# Altium project EDR - Water Meter (Test point).PrjPcb
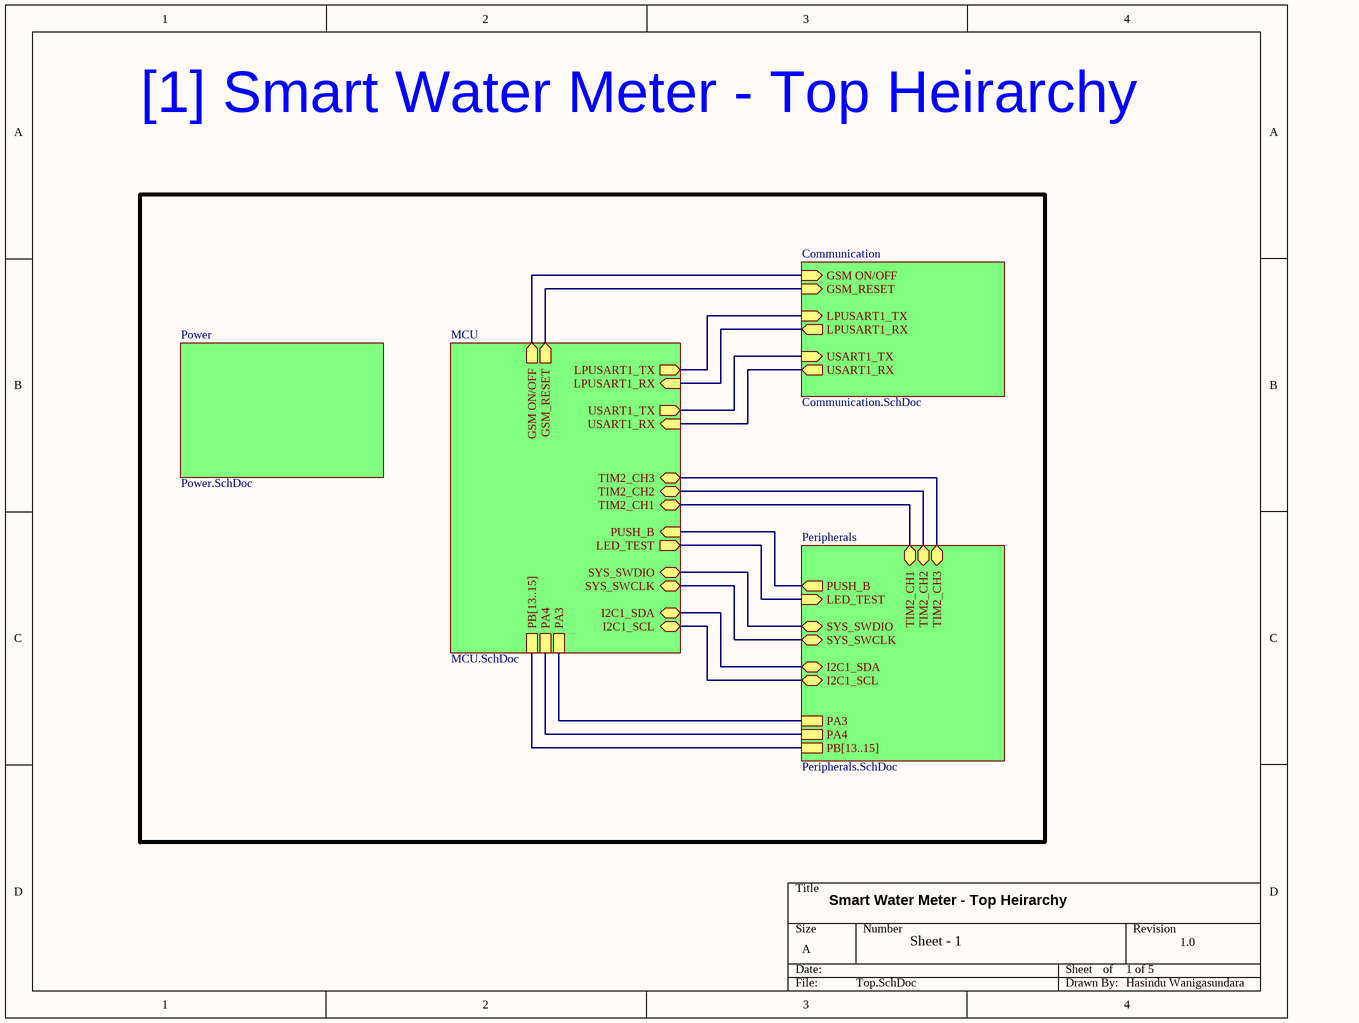
[diagram p0: Top.SchDoc]
5 sheets, 60 parts. Net scope: hierarchical (ports join the sheet entries above them; power ports are global).
Board file: EDR - Water Meter.PcbDoc
Sheets:
  Top.SchDoc
    Communication = Communication.SchDoc
    MCU = MCU.SchDoc
    Peripherals = Peripherals.SchDoc
    Power = Power.SchDoc

## Sheet Top.SchDoc
size A; SheetNumber: 1; SheetTotal: 5

### Sub-sheets
Communication = Communication.SchDoc: USART1_RX (out), USART1_TX (in), LPUSART1_RX (out), LPUSART1_TX (in), GSM_RESET (in), GSM ON/OFF (in)
MCU = MCU.SchDoc: SYS_SWDIO (bidir), SYS_SWCLK (bidir), PUSH_B (in), LED_TEST (out), LPUSART1_TX (out), LPUSART1_RX (in), USART1_TX (out), USART1_RX (in), GSM_RESET (out), GSM ON/OFF (out), I2C1_SCL (bidir), I2C1_SDA (bidir), PA3, PA4, PB[13..15], TIM2_CH1 (bidir), TIM2_CH2 (bidir), TIM2_CH3 (bidir)
Peripherals = Peripherals.SchDoc: SYS_SWDIO (bidir), SYS_SWCLK (bidir), PUSH_B (out), LED_TEST (in), I2C1_SCL (bidir), PA3, PA4, I2C1_SDA (bidir), PB[13..15], TIM2_CH1 (bidir), TIM2_CH2 (bidir), TIM2_CH3 (bidir)
Power = Power.SchDoc: no entries

### Nets
I2C1_SCL: sheet MCU/I2C1_SCL, sheet Peripherals/I2C1_SCL
I2C1_SDA: sheet MCU/I2C1_SDA, sheet Peripherals/I2C1_SDA
NetB50_2: sheet MCU/LED_TEST, sheet Peripherals/LED_TEST
NetJ51_1: sheet MCU/PA3, sheet Peripherals/PA3
NetJ51_2: sheet MCU/PA4, sheet Peripherals/PA4
NetJ52_3: sheet MCU/TIM2_CH2, sheet Peripherals/TIM2_CH2
NetJ53_3: sheet MCU/TIM2_CH1, sheet Peripherals/TIM2_CH1
NetJ54_3: sheet MCU/TIM2_CH3, sheet Peripherals/TIM2_CH3
NetJ55_1: sheet MCU/PUSH_B, sheet Peripherals/PUSH_B
NetP51_2: sheet MCU/SYS_SWDIO, sheet Peripherals/SYS_SWDIO
NetP51_3: sheet MCU/SYS_SWCLK, sheet Peripherals/SYS_SWCLK
NetR41_1: sheet Communication/GSM ON/OFF, sheet MCU/GSM ON/OFF
NetS41_1: sheet Communication/GSM_RESET, sheet MCU/GSM_RESET
NetS42_1: sheet Communication/USART1_TX, sheet MCU/USART1_TX
NetS43_1: sheet Communication/LPUSART1_TX, sheet MCU/LPUSART1_TX
NetS44_1: sheet Communication/LPUSART1_RX, sheet MCU/LPUSART1_RX
NetS45_1: sheet Communication/USART1_RX, sheet MCU/USART1_RX

### Buses and harness runs
bus sheet MCU/PB[13..15] = sheet Peripherals/PB[13..15]

### Notes on the sheet
- [1] Smart Water Meter - Top Heirarchy
- Smart Water Meter - Top Heirarchy
- Sheet - 1
- 1 of 5
- 1.0
- Hasindu Wanigasundara

## Sheet Communication.SchDoc
size A; SheetNumber: 4; SheetTotal: 5
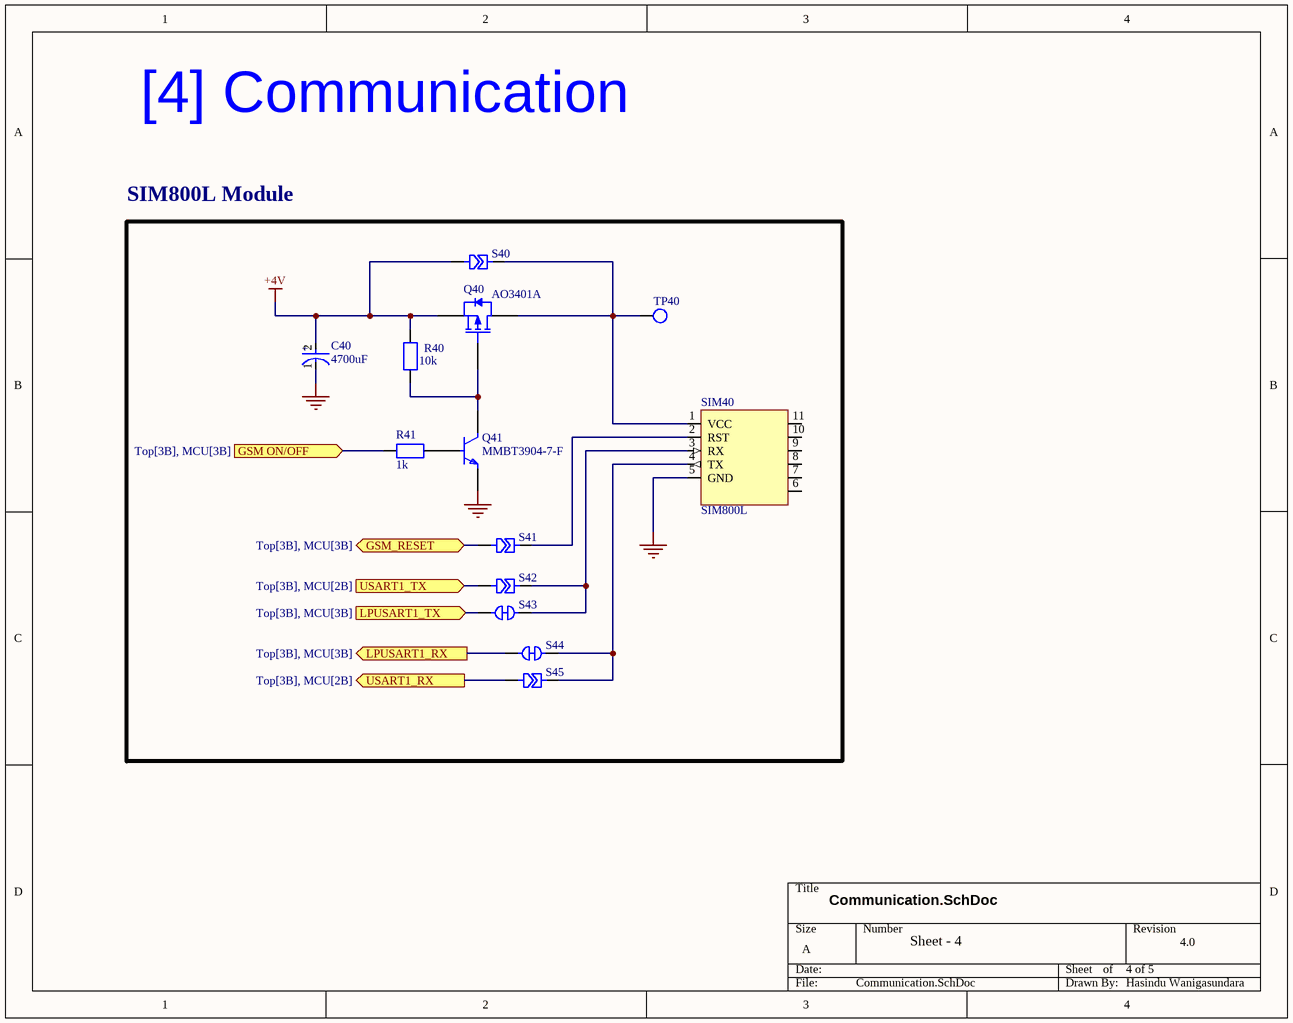
[diagram p1: Communication.SchDoc]

### Parts
C40  4700uF  [FP-RAD-TH-D_12_5_0_5-L_30-MFG]
Q40  AO3401A  [AO-SOT-23-3L_V]
Q41  MMBT3904-7-F  [FP-SOT23-IPC_A]
R40  10k  [RES_1206]
R41  1k  [RES_1206]
S40  Triangular SB  [Solder Bridge Triangular]  (value not drawn)
S41  Triangular SB  [Solder Bridge Triangular]  (value not drawn)
S42  Triangular SB  [Solder Bridge Triangular]  (value not drawn)
S43  Soldering Bridge close  [Circular jumper close]  (value not drawn)  (net tie, no BOM)
S44  Soldering Bridge close  [Circular jumper close]  (value not drawn)  (net tie, no BOM)
S45  Triangular SB  [Solder Bridge Triangular]  (value not drawn)
SIM40  SIM800L  [SIM800L]
TP40  Test Pad  [Test Pad]  (value not drawn)

### Blocks framed on the sheet
SIM800L Module: C40 Q40 Q41 R40 R41 S40-S45 SIM40 TP40

### Ports
GSM ON/OFF (in, see Top[3B], MCU[3B]), GSM_RESET (bidir, see Top[3B], MCU[3B]), LPUSART1_RX (out, see Top[3B], MCU[3B]), LPUSART1_TX (in, see Top[3B], MCU[3B]), USART1_RX (out, see Top[3B], MCU[2B]), USART1_TX (in, see Top[3B], MCU[2B])

### Nets
+4V: C40.2(A) Q40.2(SOURCE) R40.1 S40.1
GND: C40.1(C) Q41.2(E) SIM40.5(GND)
NetQ40_1: Q40.1(GATE) Q41.3(C) R40.2
NetQ40_3: Q40.3(DRAIN) S40.2 SIM40.1(VCC) TP40.1
NetQ41_1: Q41.1(B) R41.2
NetR41_1: R41.1 ; port GSM ON/OFF
NetS41_1: S41.1 ; port GSM_RESET
NetS41_2: S41.2 SIM40.2(RST)
NetS42_1: S42.1 ; port USART1_TX
NetS42_2: S42.2 S43.2 SIM40.3(RX)
NetS43_1: S43.1 ; port LPUSART1_TX
NetS44_1: S44.1 ; port LPUSART1_RX
NetS44_2: S44.2 S45.2 SIM40.4(TX)
NetS45_1: S45.1 ; port USART1_RX

Not connected (* = marked no-connect by the designer): SIM40 6 7 8 9 10 11

### Notes on the sheet
- [4] Communication
- Communication.SchDoc
- Sheet - 4
- 4 of 5
- 4.0
- Hasindu Wanigasundara
- (in symbol CMP-05427-000691-1) +

### Library data of the parts
C40 = CMP-05427-000691-1: Aluminum Electrolytic Capacitors (Radial Lead Type) AEC-Q200 Qualified 4700uF ±20% 10V
Q40 = CMP-2000-05778-1: P-Channel MOSFET, 30 V, 4 A, -55 to 150 degC, 3-Pin SOT-23-3L, RoHS, Tape and Reel; Manufacturer: Alpha and Omega; Output Power (Max): NotRequiredW; Power Dissipation: 1.4W; Rad Hardened: No; Drain Efficiency: NotRequired%; Drain-Source On-Volt: 30V; Noise Figure: NotRequireddB; Frequency (Max): NotRequiredMHz; Number of  Elements: 1; Gate-Source Voltage (Max): ?12V; Drain Current (Max): 4A; Channel Mode: Enhancement; Drain-Source On-Res: 0.044ohm; Type: PowerMOSFET; Polarity: P; Package URL: http://www.aosmd.com/res/packaging_information/SOT-23-3L.pdf; Datasheet URL: http://www.aosmd.com/res/data_sheets/AO3401A.pdf; Package Type: SOT-23; Package Description: 3-Pin Small Outline Transistor, Body 2.95 x 1.6 mm, Pitch 0.95 mm; Mounting: SurfaceMount; Manufacturer URL: http://www.aosmd.com/; Continuous Drain Current: 4A; Package Reference: SOT-23-3L; Mounting Technology: SurfaceMount; Operating Temperature Classification: Military; Power Gain: NotRequireddB; Datasheet Version: Rev. 3, 03/2011; Operating Temp Range: -55Cto150C; Pin Count: 3
Q41 = CMP-2000-04931-2: TRANS NPN 40V 0.2A SMD SOT23-3; Frequency: 300MHz; Power Dissipation: 350mW; Element Configuration: Single; Max Power Dissipation: 300mW; Max Collector Current: 200mA; Collector Emitter Saturation Voltage: 300mV; Number of Elements: 1; hFE Min: 100; Collector Base Voltage (VCBO): 60V; Emitter Base Voltage (VEBO): 6V; Contact Plating: Tin; Package Quantity: 3000; Max Frequency: 300MHz; REACH SVHC: No SVHC; Max Operating Temperature: 150°C; Width: 1.4mm; Collector Emitter Voltage (VCEO): 40V; Voltage Rating (DC): 40V; Radiation Hardening: No; Case/Package: SOT-23; Height: 1mm; Collector Emitter Breakdown Voltage: 40V; Length: 3.05mm; Polarity: NPN; Packaging: Tape and Reel; Number of Pins: 3; Min Operating Temperature: -55°C; Gain Bandwidth Product: 300MHz; Mount: Surface Mount; Weight: 0.000282oz; Continuous Collector Current: 200mA; Transition Frequency: 300MHz; Max Breakdown Voltage: 40V; Lead Free: Lead Free
R40 R41 = RES_1206: SMD 3.2mm × 1.6mm size resistor (1206); Manufacturer: *; Manufacturer part number: *
S40-S42 S45 = Triangular SB: Solder Bridge triangular closed
S43 S44 = Soldering Bridge close: Soldering Bridge close SMD
SIM40 = SIM800L: SIM800L through hole gsm module

## Sheet MCU.SchDoc
size A; SheetNumber: 3; SheetTotal: 5
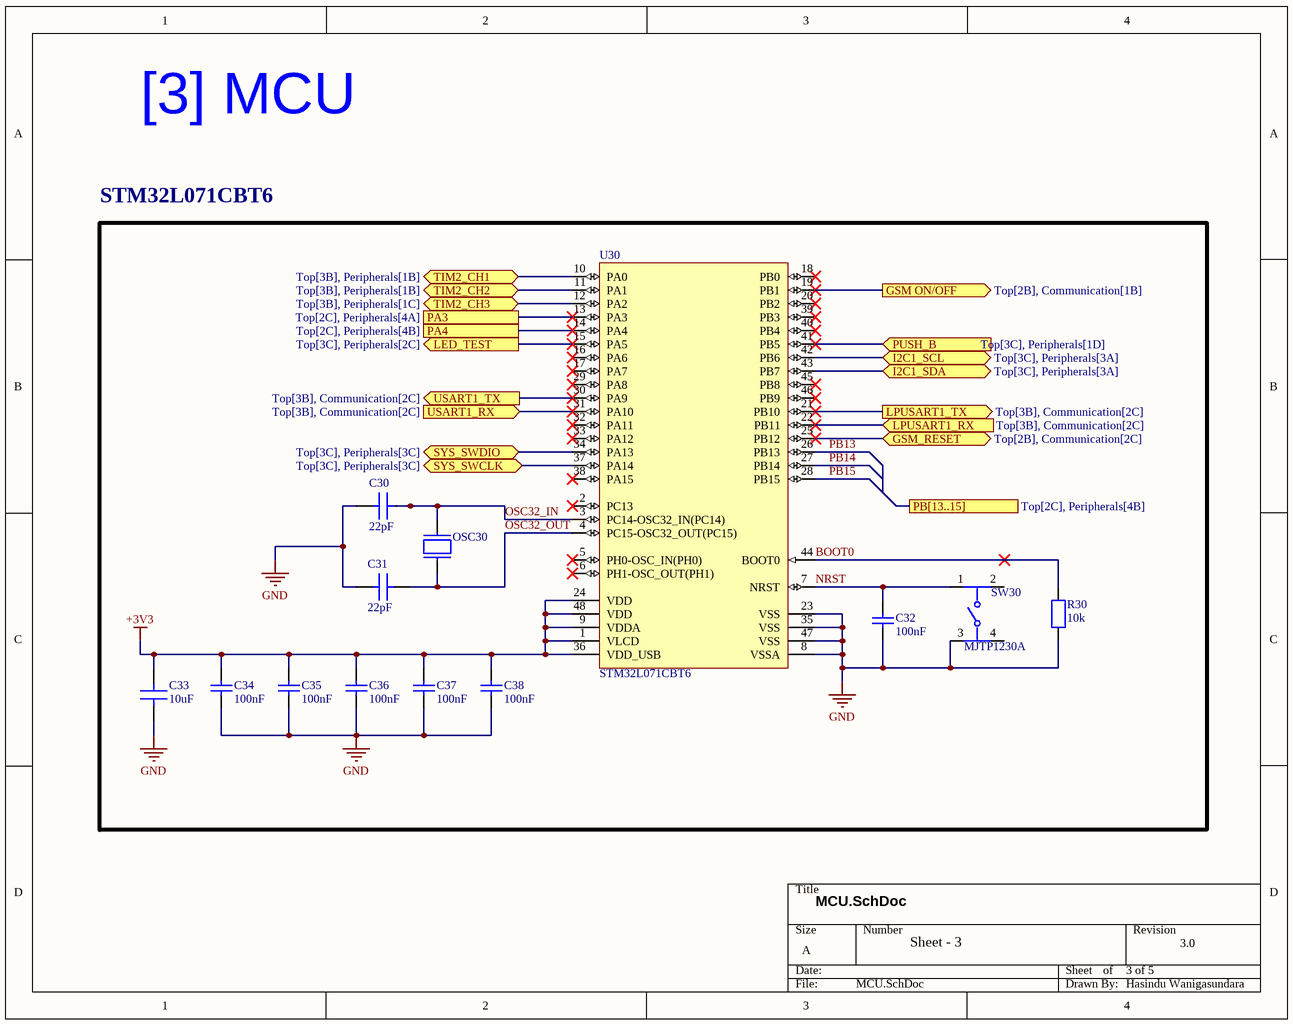
[diagram p2: MCU.SchDoc]

### Parts
C30  22pF  [CAP_1206]
C31  22pF  [CAP_1206]
C32  100nF  [CAPC2013X140X50NL20T25]
C33  10uF  [CAP_1206]
C34  100nF  [CAPC2013X140X50NL20T25]
C35  100nF  [CAPC2013X140X50NL20T25]
C36  100nF  [CAPC2013X140X50NL20T25]
C37  100nF  [CAPC2013X140X50NL20T25]
C38  100nF  [CAPC2013X140X50NL20T25]
OSC30  CRYSTAL OSC  [Crystal_OSC]  (value not drawn)
R30  10k  [RES_1206]
SW30  MJTP1230A  [FP-MJTP1230A-MFG]
U30  STM32L071CBT6  [STM-LQFP48_M]

### Blocks framed on the sheet
STM32L071CBT6: C30-C38 OSC30 R30 SW30 U30

### Ports
GSM ON/OFF (out, see Top[2B], Communication[1B]), GSM_RESET (bidir, see Top[2B], Communication[2C]), I2C1_SCL (bidir, see Top[3C], Peripherals[3A]), I2C1_SDA (bidir, see Top[3C], Peripherals[3A]), LED_TEST (out, see Top[3C], Peripherals[2C]), LPUSART1_RX (in, see Top[3B], Communication[2C]), LPUSART1_TX (out, see Top[3B], Communication[2C]), PA3 (see Top[2C], Peripherals[4A]), PA4 (see Top[2C], Peripherals[4B]), PB[13..15] (see Top[2C], Peripherals[4B]), PUSH_B (in, see Top[3C], Peripherals[1D]), SYS_SWCLK (bidir, see Top[3C], Peripherals[3C]), SYS_SWDIO (bidir, see Top[3C], Peripherals[3C]), TIM2_CH1 (bidir, see Top[3B], Peripherals[1B]), TIM2_CH2 (bidir, see Top[3B], Peripherals[1B]), TIM2_CH3 (bidir, see Top[3B], Peripherals[1C]), USART1_RX (in, see Top[3B], Communication[2C]), USART1_TX (out, see Top[3B], Communication[2C])

### Nets
+3V3: C33.2 C34.2 C35.2 C36.2 C37.2 C38.2 U30.1(VLCD) U30.9(VDDA) U30.24(VDD) U30.36(VDD_USB) U30.48(VDD)
GND: C30.2 C31.1 C32.1 C33.1 C34.1 C35.1 C36.1 C37.1 C38.1 R30.2 SW30.3 U30.8(VSSA) U30.23(VSS) U30.35(VSS) U30.47(VSS)
BOOT0: R30.1 U30.44(BOOT0)
I2C1_SCL: U30.42(PB6) ; port I2C1_SCL
I2C1_SDA: U30.43(PB7) ; port I2C1_SDA
NRST: C32.2 SW30.1 U30.7(NRST)
OSC32_IN: C30.1 OSC30.2 U30.3(PC14-OSC32_IN(PC14))
OSC32_OUT: C31.2 OSC30.1 U30.4(PC15-OSC32_OUT(PC15))
PB13: U30.26(PB13)
PB14: U30.27(PB14)
PB15: U30.28(PB15)
NetB50_2: U30.15(PA5) ; port LED_TEST
NetJ51_1: U30.13(PA3) ; port PA3
NetJ51_2: U30.14(PA4) ; port PA4
NetJ52_3: U30.11(PA1) ; port TIM2_CH2
NetJ53_3: U30.10(PA0) ; port TIM2_CH1
NetJ54_3: U30.12(PA2) ; port TIM2_CH3
NetJ55_1: U30.41(PB5) ; port PUSH_B
NetP51_2: U30.34(PA13) ; port SYS_SWDIO
NetP51_3: U30.37(PA14) ; port SYS_SWCLK
NetR41_1: U30.19(PB1) ; port GSM ON/OFF
NetS41_1: U30.25(PB12) ; port GSM_RESET
NetS42_1: U30.30(PA9) ; port USART1_TX
NetS43_1: U30.21(PB10) ; port LPUSART1_TX
NetS44_1: U30.22(PB11) ; port LPUSART1_RX
NetS45_1: U30.31(PA10) ; port USART1_RX

Not connected (* = marked no-connect by the designer): SW30 2 4; U30 2(PC13)* 5(PH0-OSC_IN(PH0))* 6(PH1-OSC_OUT(PH1))* 16(PA6)* 17(PA7)* 18(PB0)* 20(PB2)* 29(PA8)* 32(PA11)* 33(PA12)* 38(PA15)* 39(PB3)* 40(PB4)* 45(PB8)* 46(PB9)*

### Notes on the sheet
- [3] MCU
- MCU.SchDoc
- Sheet - 3
- 3 of 5
- 3.0
- Hasindu Wanigasundara

### Library data of the parts
C30 C31 C33 = CAP_1206: SMD 3.2mm × 1.6mm size capacitor (1206); Manufacturer: *; Manufacturer Part Number: *
C32 C34-C38 = CMP-2007-04663-1: Part Number: 0805YD105MAT2A; Manufacturer: AVX Interconnect / Elco
OSC30 = CRYSTAL OSC: CRYSTAL 32.768kHz 12.5pF SMD
R30 = RES_1206: SMD 3.2mm × 1.6mm size resistor (1206); Manufacturer: *; Manufacturer part number: *
SW30 = CMP-47024-000004-1: SWITCH TACTILE SPST-NO 0.05A 12V; Mechanical Life: 100000Cycles; Throw Configuration: SPST; Actuator Length: 1.4mm; Switch Travel: 0.25mm; Actuator Color: Black; Operating Force: 160gf; Contact Resistance: 100mR; Actuator Type: Standard; Switch Function: Off-Mom; Actuator Material: Thermoplastic; Illumination Type: Non-Illuminated; Current Rating: 50mA; Min Operating Temperature: -20°C; Series: MJTP; Electrical Life: 100000Cycles; Mount: Through Hole; Packaging: Bulk; Color: Black; Package Quantity: 2000; Voltage Rating (DC): 12V; REACH SVHC: No SVHC; Orientation: Straight; Termination: PC Pin; Contact Material: Bronze; RoHS Compliant: Yes; Max Voltage Rating (DC): 12V; Max Operating Temperature: 70°C; Contact Plating: Silver
U30 = CMP-1546-00070-1: ARM Cortex-M0+ 32 Bit 32MHz 37 LQFP-48(7x7) Microcontrollers RoHS; Operating Frequency(F) (Processor speed) (MHz): 32; FLASH Size (Prog) (kB): 192; Supply Voltage(Vcc) min (V): 1.8; Internal RAM Size (kB): 20; I/Os (High Current): 40; Data E2PROM nom (B): 6144; D/A Converter: 2; Packing: Tray; Core: ARM Cortex-M0+; DatasheetVersion: Rev. 2; ComponentLink1Description: Manufacturer URL; ComponentLink2Description: Datasheet; Package Description: 48-Pin Low Profile Quad Flat Package, Body 7 x 7 mm, Pitch 0.5 mm; Mounting Technology: Surface Mount; Package Reference: LQFP48; ComponentLink1URL: http://www.st.com/; ComponentLink2URL: http://www.st.com/st-web-ui/static/active/en/resource/technical/document/datasheet/DM00141036.pdf

## Sheet Peripherals.SchDoc
size A; SheetNumber: 5; SheetTotal: 5
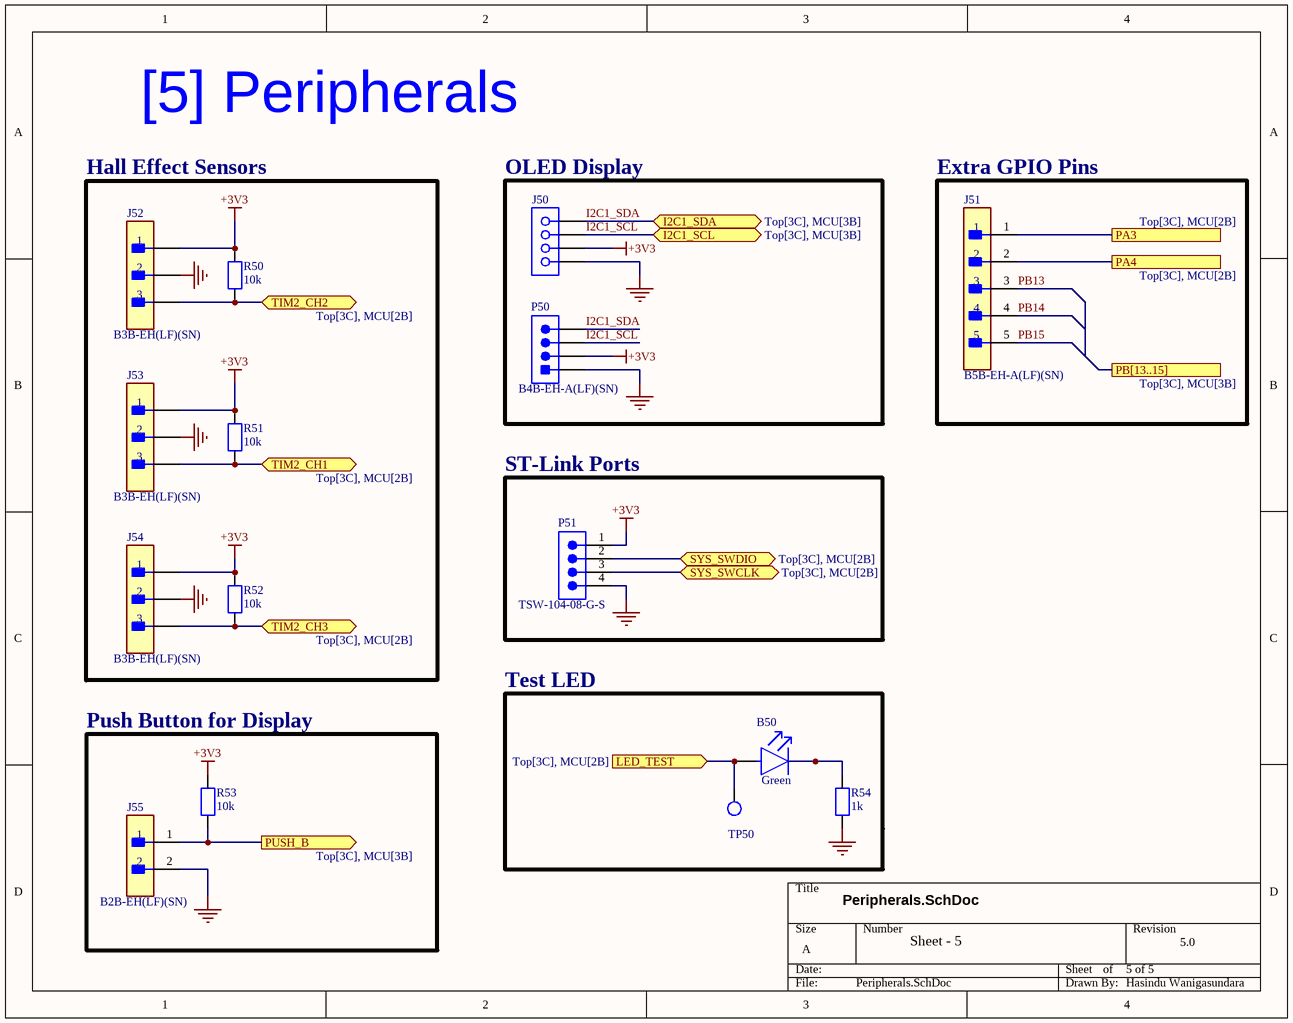
[diagram p3: Peripherals.SchDoc]

### Parts
B50  Green  [FP-LTST-C171GKT-MFG]
J50  61300411821  [61300411821]  (value not drawn)
J51  B5B-EH-A(LF)(SN)  [FP-B5B-EH-A_LF_SN-MFG]
J52  B3B-EH(LF)(SN)  [FP-B3B-EH_LF_SN-MFG]
J53  B3B-EH(LF)(SN)  [FP-B3B-EH_LF_SN-MFG]
J54  B3B-EH(LF)(SN)  [FP-B3B-EH_LF_SN-MFG]
J55  B2B-EH(LF)(SN)  [FP-B2B-EH_LF_SN-MFG]
P50  B4B-EH-A(LF)(SN)  [JST-B4B-EH-A_V]
P51  TSW-104-08-G-S  [SMTC-TSW-104-08-X-S]
R50  10k  [RES_1206]
R51  10k  [RES_1206]
R52  10k  [RES_1206]
R53  10k  [RES_1206]
R54  1k  [RES_1206]
TP50  Test Pad  [Test Pad]  (value not drawn)

### Blocks framed on the sheet
Hall Effect Sensors: J52-J54 R50-R52
OLED Display: J50 P50
Extra GPIO Pins: J51
ST-Link Ports: P51
Push Button for Display: J55 R53

### Ports
I2C1_SCL (bidir, see Top[3C], MCU[3B]), I2C1_SDA (bidir, see Top[3C], MCU[3B]), LED_TEST (in, see Top[3C], MCU[2B]), PA3 (see Top[3C], MCU[2B]), PA4 (see Top[3C], MCU[2B]), PB[13..15] (see Top[3C], MCU[3B]), PUSH_B (out, see Top[3C], MCU[3B]), SYS_SWCLK (bidir, see Top[3C], MCU[2B]), SYS_SWDIO (bidir, see Top[3C], MCU[2B]), TIM2_CH1 (bidir, see Top[3C], MCU[2B]), TIM2_CH2 (bidir, see Top[3C], MCU[2B]), TIM2_CH3 (bidir, see Top[3C], MCU[2B])

### Nets
+3V3: J50.2 J52.1 J53.1 J54.1 P50.2 P51.1 R50.2 R51.2 R52.2 R53.2
GND: J50.1 J52.2 J53.2 J54.2 J55.2 P50.1 P51.4 R54.1
I2C1_SCL: J50.3 P50.3 ; port I2C1_SCL
I2C1_SDA: J50.4 P50.4 ; port I2C1_SDA
PB13: J51.3
PB14: J51.4
PB15: J51.5
NetB50_1: B50.1(C) R54.2
NetB50_2: B50.2(A) TP50.1 ; port LED_TEST
NetJ51_1: J51.1 ; port PA3
NetJ51_2: J51.2 ; port PA4
NetJ52_3: J52.3 R50.1 ; port TIM2_CH2
NetJ53_3: J53.3 R51.1 ; port TIM2_CH1
NetJ54_3: J54.3 R52.1 ; port TIM2_CH3
NetJ55_1: J55.1 R53.1 ; port PUSH_B
NetP51_2: P51.2 ; port SYS_SWDIO
NetP51_3: P51.3 ; port SYS_SWCLK

### Notes on the sheet
- [5] Peripherals
- Test LED
- Peripherals.SchDoc
- Sheet - 5
- 5 of 5
- 5.0
- Hasindu Wanigasundara

### Library data of the parts
B50 = CMP-22017-000007-1: LED GREEN CLEAR CHIP SMD; Luminous Intensity: 12mcd; Lens Color: Colorless; Dominant Wavelength: 569nm; Number of LEDs: 1; Power Dissipation: 100mW; Viewing Angle: 130°; Reverse Voltage: 5V; Test Current: 10mA; Forward Voltage: 2.1V; Wavelength: 585nm; Lens Style: Diffused; Forward Current: 30mA; Height: 0.8mm; Mount: Surface Mount; Package Quantity: 1; Length: 2mm; Case Code (Metric): 2012; Number of Pins: 2; Number of Elements: 1; Packaging: Tape and Reel; Color: Green; Min Operating Temperature: -55°C; Case/Package: 0805; Power Rating: 100mW; Max Operating Temperature: 85°C; Radiation Hardening: No; Depth: 1.25mm; Lens Transparency: Clear; Width: 1.25mm; Lead Free: Lead Free; Case Code (Imperial): 0805; Illumination Color: Green
J50 = CMP-1502-01316-4: THT Vertical Socket Header WR-PHD, Pitch 2.54 mm, Single Row, 4 pins; Current Rating: 3A; Gender: Female; Contact Resistance: 20mΩ; Operating Supply Voltage: 250V; Number of Pins: 4; Lead Pitch: 2.54mm; Orientation: Vertical
J51 = CMP-17439-000382-1: CONN HEADER VERT 5POS 2.5MM; Number of Contacts: 5; Mated Stacking Heights: 8.1mm; Current Rating: 3A; Gender: Male; Voltage Rating: 250V; Lead Free: Lead Free; Fastening Type: Friction; Contact Type: Male Pin; Insulation Color: Natural; Insulation Material: Nylon; Contact Material: Brass; Contact Mating Length: 0.13inch; Pitch: 2.5mm; Number of Positions: 5; Number of Rows: 1; Connector Type: Header; Color: Natural; Contact Shape: Square; Flammability Rating: UL94 V-0; Orientation: Straight; Packaging: Bulk; Mount: Through Hole; Contact Finish - Mating: TIN; Contact Plating: Tin; Series: EH; Termination: Solder; Housing Color: White
J52-J54 = CMP-17439-000692-1: 3 Position Single Row 2.5 mm Press Fit Through Hole Shrouded Pin Header; Voltage Rating: 250V; Pitch: 2.5mm; Current Rating: 3A; Number of Positions: 3; Termination: Solder; Contact Material: Brass; Series: EH; Mount: Through Hole; Number of Contacts: 3; Number of Rows: 1; Lead Free: Lead Free; Orientation: Straight
J55 = CMP-17439-000683-1: Connector Header, EH Series, 2 Position, 2.5mm, Through Hole, Press-Fit, Solder, Natural; Voltage Rating: 250V; Current Rating: 3A; Number of Positions: 2; Lead Free: Lead Free; Series: EH; Orientation: Straight; Pitch: 2.5mm; Termination: Solder; Mount: Through Hole; Number of Rows: 1; Contact Material: Brass; Number of Contacts: 2
P50 = CMP-2000-05904-1: Male Header, Pitch 2.5 mm, 1 x 4 Position, Height 6 mm, Tail Length 3.2 mm, -25 to 85 degC, RoHS, Bulk; Manufacturer: JST; Style/Orientation: StraightHeader/Plug; Pitch: 2.5mm; No of Positions: 4; Mounting Technology: SurfaceMount; Package Description: Male Header, Pitch 2.5 mm, 1 x 4 Position, Height 6 mm, Tail Length 3.2 mm; Datasheet Version: 12/2012; Type: ShroudedHeader; Package Reference: B4B-EH-A; Manufacturer URL: http://www.jst.com/home2.html; Termination: Crimp; Datasheet URL: http://www.jst-mfg.com/product/pdf/eng/eEH.pdf
P51 = CMP-1024-00357-1: 0.025" SQ Post Header, Through-hole, Vertical, -55 to 125 degC, 2.54 mm Pitch, 4-Pin, Male, RoHS; Manufacturer: Samtec; Pitch: 2.54 mm; RoHS: True; ComponentLink3URL: http://www.samtec.com/documents/webfiles/cpdf/TSW-XXX-XX-XXX-X-XX-XXX-MKT.pdf; Mounting Technology: Through-hole; ComponentLink2URL: http://www.samtec.com/documents/webfiles/pdf/TSW_TH.PDF; ComponentLink1URL: http://www.samtec.com; ComponentLink3Description: Package Specification; PackageVersion: DM, 8/1988; ComponentLink2Description: Datasheet; PackageReference: TSW-104-08-X-S; PackageDescription: .025[0.64] SQ. Post Terminal Strip Assembly; PartNumber: TSW-104-08-G-S; ComponentLink1Description: Manufacturer URL; Temperature Range: -55 to 125 degC; DatasheetVersion: F-214; Orientation: Vertical
R50-R54 = RES_1206: SMD 3.2mm × 1.6mm size resistor (1206); Manufacturer: *; Manufacturer part number: *

## Sheet Power.SchDoc
size A; SheetNumber: 2; SheetTotal: 5
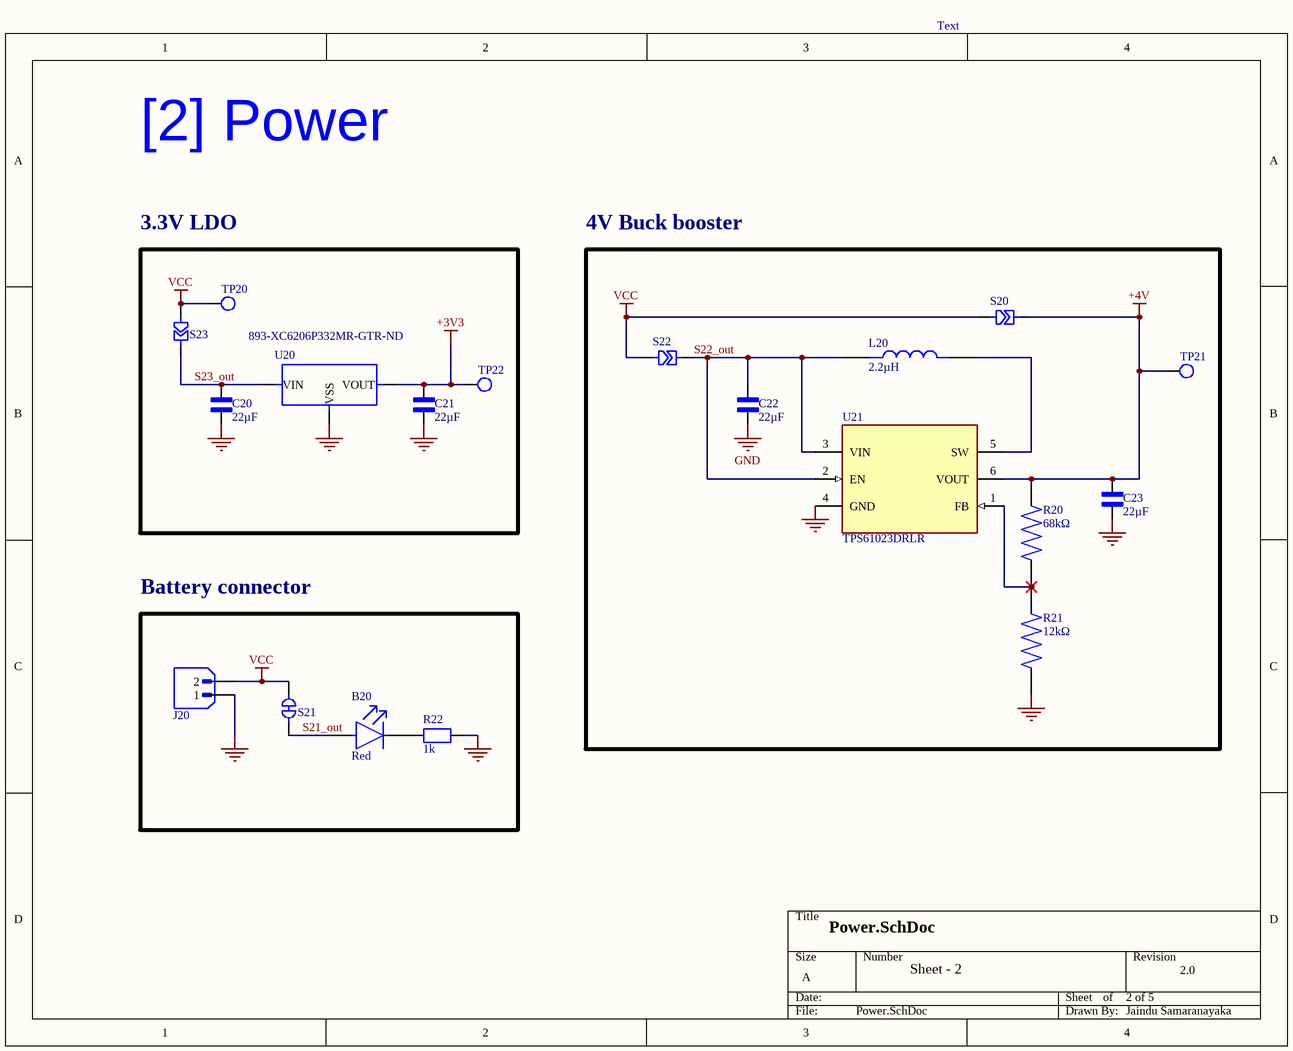
[diagram p4: Power.SchDoc]

### Parts
B20  Red  [FP-5988110107F-MFG]
C20  value 22µF  [CAPC3225X270N]  (hidden comment: 22uf)
C21  value 22µF  [CAPC3225X270N]  (hidden comment: 22uf)
C22  value 22µF  [CAPC3225X270N]  (hidden comment: 22uf)
C23  value 22µF  [CAPC3225X270N]  (hidden comment: 22uf)
J20  jst 2  [JST_B2B-XH-A]  (value not drawn)
L20  value 2.2µH  [IND_XFL4020-222MEC]  (hidden comment: 2.2uh)
R20  value 68kΩ  [RESC3216X70N]  (hidden comment: 68k)
R21  value 12kΩ  [RES_ERJPB6B1202V]  (hidden comment: 12k)
R22  1k  [RES_1206]
S20  Triangular SB  [Solder Bridge Triangular]  (value not drawn)
S21  Soldering Bridge close  [Circular jumper close]  (value not drawn)  (net tie, no BOM)
S22  Triangular SB  [Solder Bridge Triangular]  (value not drawn)
S23  Triangular SB  [Solder Bridge Triangular]  (value not drawn)
TP20  Test Pad  [Test Pad]  (value not drawn)
TP21  Test Pad  [Test Pad]  (value not drawn)
TP22  Test Pad  [Test Pad]  (value not drawn)
U20  Supplier Part Number: 893-XC6206P332MR-GTR-ND  [SOT-23]  (hidden comment: PMIC-LDO-XC6206P332MR-G(SOT23))
U21  TPS61023DRLR  [DRL0006A]

### Blocks framed on the sheet
3.3V LDO: C20 C21 S23 TP20 TP22 U20
4V Buck booster: C22 C23 L20 R20 R21 S20 S22 TP21 U21
Battery connector: B20 J20 R22 S21

### Nets
+3V3: C21.2 TP22.1 U20.2(VOUT)
+4V: C23.2 R20.2 S20.2 TP21.1 U21.6(VOUT)
GND: C20.1 C21.1 C22.1 C23.1 J20.1 R21.1 R22.1 U20.1(VSS) U21.4(GND)
VCC: J20.2 S20.1 S21.1 S22.1 S23.1 TP20.1
S21_out: B20.2(A) S21.2
S22_out: C22.2 L20.1 S22.2 U21.2(EN) U21.3(VIN)
S23_out: C20.2 S23.2 U20.3(VIN)
NetB20_1: B20.1(C) R22.2
NetL20_2: L20.2 U21.5(SW)
NetR20_1: R20.1 R21.2 U21.1(FB)

### Notes on the sheet
- Text
- [2] Power
- Sheet - 2
- 2 of 5
- 2.0
- Jaindu Samaranayaka

### Library data of the parts
B20 = CMP-00106-00868569-1: 598-8110-107F 598-8110-107F, Dialight, SMD LED 0805 Package, Red Single color SOLD IN INCREMENTS OF 4000. (REEL); NexarPartId: 868569; Wavelength: 635nm; Forward Current: 20mA; Lens Style: Clear; Forward Voltage: 2.2V; Power Dissipation: 60mW; Max Junction Temperature (Tj): 105°C; Luminous Intensity: 40mcd; Viewing Angle: 140°; Reverse Voltage: 5V; Number of LEDs: 1; Number of Pins: 2; Schedule B: 8541402000, 8541402000; Length: 2mm; Width: 1.25mm; Mount: Surface Mount; Height: 800µm; Case Code (Imperial): 0805; Case Code (Metric): 2012; RoHS: Compliant; Min Operating Temperature: -30°C; Color: Red; Case/Package: 0805; Depth: 1.25mm; Lead Free: Lead Free; Max Operating Temperature: 85°C; Test Current: 20mA; Illumination Color: Red; Number of Elements: 1; Dominant Wavelength: 635nm; REACH SVHC: No SVHC; Radiation Hardening: No
C20-C23 = CAPC3225X270N: 25V 22uF X7R 卤10% 1210 Multilayer Ceramic Capacitors MLCC - SMD/SMT ROHS; Manufacturer: Samsung Electro-Mechanics; Manufacturer Part Number: CL32B226KAJNNNE; Tolerance: 10%; Supplier: Future Electronics; Supplier Part Number: CL32B226KAJNNNE; RoHS: Compliant; Category: Ceramic Capacitors; Stock: 1822000; Pricing: 1000=0.106, 3000=0.103, 5000=0.102, 15000=0.0993, 25000=0.0969 (USD); Case/Package: 1210; Case Code (Imperial): 1210; Case Code (Metric): 3225; China RoHS: Compliant; Country of Origin: Mainland China, Philippines, South Korea; Depth: 2.5mm; Dielectric: X7R; Dielectric Material: Ceramic; Export Control Classification Number (ECCN) Code: EAR99; Height: 2.7mm; Harmonized Tariff Schedule (HTS) Code: 8532.24.00.20; Introduction Date: 2010-04-14; Lead Free: Lead Free; Length: 3.2mm; Lifecycle Status: Production; Material: Ceramic; Max Operating Temperature: 125°C; Min Operating Temperature: -55°C; Mounting Technology: Surface Mount; Number of Terminals: 2; Radiation Hardening: No; REACH SVHC: Yes; Schedule B: 8532240020, 8532240020|8532240020|8532240020|8532240020|8532240020|8532240020|8532240020|8532240020|8532240020|8532240020|8532240020|8532240020|8532240020|8532240020|8532240020|8532240020|8532240020|8532240020|8532240020|8532240020|8532240020|8532240020|8532240020|85; Thickness: 2.6924mm; Voltage Rating: 25V; Voltage Rating (DC): 25V; Width: 2.5mm; ComponentLink1URL: https://datasheet.octopart.com:443/CL32B226KAJNNNE-Samsung-Electro-Mechanics-datasheet-136482669.pdf?src-supplier=Newark; ComponentLink1Description: https://datasheet.octopart.com:443/CL32B226KAJNNNE-Samsung-Electro-Mechanics-datasheet-136482669.pdf?src-supplier=Newark; ComponentLink2URL: https://datasheet.octopart.com:443/CL32B226KAJNNNE-Samsung-Electro-Mechanics-datasheet-149049204.pdf?src-supplier=Future+Electronics; ComponentLink2Description: https://datasheet.octopart.com:443/CL32B226KAJNNNE-Samsung-Electro-Mechanics-datasheet-149049204.pdf?src-supplier=Future+Electronics; ComponentLink3URL: https://datasheet.octopart.com:443/CL32B226KAJNNNE-Samsung-Electro-Mechanics-datasheet-116051342.pdf?src-supplier=Future+Electronics; ComponentLink3Description: https://datasheet.octopart.com:443/CL32B226KAJNNNE-Samsung-Electro-Mechanics-datasheet-116051342.pdf?src-supplier=Future+Electronics; ComponentLink4URL: https://datasheet.octopart.com:443/CL32B226KAJNNNE-Samsung-Electro-Mechanics-datasheet-81462649.pdf?src-supplier=Future+Electronics; ComponentLink4Description: https://datasheet.octopart.com:443/CL32B226KAJNNNE-Samsung-Electro-Mechanics-datasheet-81462649.pdf?src-supplier=Future+Electronics; ComponentLink5URL: https://datasheet.octopart.com:443/CL32B226KAJNNNE-Samsung-datasheet-42485260.pdf?src-supplier=Future+Electronics; ComponentLink5Description: https://datasheet.octopart.com:443/CL32B226KAJNNNE-Samsung-datasheet-42485260.pdf?src-supplier=Future+Electronics; ComponentLink6URL: https://datasheet.octopart.com:443/CL32B226KAJNNNE-Samsung-datasheet-28848742.pdf?src-supplier=Future+Electronics; ComponentLink6Description: https://datasheet.octopart.com:443/CL32B226KAJNNNE-Samsung-datasheet-28848742.pdf?src-supplier=Future+Electronics; ComponentLink7URL: https://datasheet.octopart.com:443/CL32B226KAJNNNE-Samsung-datasheet-37081328.pdf?src-supplier=Future+Electronics; ComponentLink7Description: https://datasheet.octopart.com:443/CL32B226KAJNNNE-Samsung-datasheet-37081328.pdf?src-supplier=Future+Electronics; ComponentLink8URL: https://datasheet.octopart.com/CL32B226KAJNNNE-Samsung-Electro-Mechanics-datasheet-97040617.pdf; ComponentLink8Description: https://datasheet.octopart.com/CL32B226KAJNNNE-Samsung-Electro-Mechanics-datasheet-97040617.pdf; ComponentLink9URL: https://datasheet.octopart.com/CL32B226KAJNNNE-Samsung-Electro-Mechanics-datasheet-8324245.pdf; ComponentLink9Description: https://datasheet.octopart.com/CL32B226KAJNNNE-Samsung-Electro-Mechanics-datasheet-8324245.pdf; ComponentLink10URL: https://datasheet.octopart.com:443/CL32B226KAJNNNE-Samsung-datasheet-59220082.pdf?src-supplier=TME; ComponentLink10Description: https://datasheet.octopart.com:443/CL32B226KAJNNNE-Samsung-datasheet-59220082.pdf?src-supplier=TME
J20 = 2pin jst: CONNECTOR HEADER, XH SERIES, 2 POSITION, 2.50MM, Press-Fit Solder, Detent Lock, Natural; Manufacturer Part Number: B2B-XH-A(LF)(SN); Connector Type: Male Pin; Contact Resistance: 20mΩ; Current Rating: 3A; Gender: Male; Insulation Resistance: 1GΩ; Max Voltage Rating (AC): 250V; Number of Contacts: 2; Pitch: 2.5mm; Ratings: TUV; Wire/Cable Gauge: 22AWG; Supplier: Arrow Electronics; Supplier Part Number: B2B-XH-A(LF)(SN); Manufacturer: JST; RoHS: Compliant; Category: Headers and Wire Housings; Stock: 85075; Pricing: 1=0.0946, 10=0.0729, 25=0.0722, 100=0.0518, 500=0.05, 1000=0.0407 (USD); China RoHS: Compliant; Color: Natural, White; Contact Material: Copper, Tin; Contact Plating: Tin; Depth: 5.75mm; Fastening Type: Detent; Height: 7mm; Housing Color: White; Housing Material: Polyamide; Lead Free: Lead Free; Lead Pitch: 2.5mm; Length: 7.4mm; Lifecycle Status: Production; Max Current Rating: 3A; Max Operating Temperature: 85°C; Max Voltage Rating (DC): 250V; Min Operating Temperature: -25°C; Mounting Technology: Through Hole; Pins: 2; Number of Positions: 2; Number of Rows: 1; Orientation: Straight; REACH SVHC: Yes; Terminal Pitch: 2.5mm; Termination: Solder; Voltage Rating: 250V; Voltage Rating (AC): 250V; Weight: 28.349523g; Width: 6.35mm; ComponentLink1URL: https://datasheet.octopart.com:443/B2B-XH-A%28LF%29%28SN%29-JST-datasheet-12510042.pdf?src-supplier=Newark; ComponentLink1Description: https://datasheet.octopart.com:443/B2B-XH-A%28LF%29%28SN%29-JST-datasheet-12510042.pdf?src-supplier=Newark; ComponentLink2URL: https://datasheet.octopart.com:443/B2B-XH-A-%28LF%29%28SN%29-JST-datasheet-41261050.pdf?src-supplier=Newark; ComponentLink2Description: https://datasheet.octopart.com:443/B2B-XH-A-%28LF%29%28SN%29-JST-datasheet-41261050.pdf?src-supplier=Newark; ComponentLink3URL: https://datasheet.octopart.com:443/B2B-XH-A%28LF%29%28SN%29-JST-datasheet-63094.pdf?src-supplier=Upverter; ComponentLink3Description: https://datasheet.octopart.com:443/B2B-XH-A%28LF%29%28SN%29-JST-datasheet-63094.pdf?src-supplier=Upverter; ComponentLink4URL: https://datasheet.octopart.com:443/B2B-XH-A%28LF%29%28SN%29-JST-datasheet-8325564.pdf?src-supplier=Burklin+Elektronik; ComponentLink4Description: https://datasheet.octopart.com:443/B2B-XH-A%28LF%29%28SN%29-JST-datasheet-8325564.pdf?src-supplier=Burklin+Elektronik; ComponentLink5URL: https://datasheet.octopart.com:443/B2B-XH-A%28LF%29%28SN%29-JST-datasheet-138896056.pdf?src-supplier=IHS; ComponentLink5Description: https://datasheet.octopart.com:443/B2B-XH-A%28LF%29%28SN%29-JST-datasheet-138896056.pdf?src-supplier=IHS; ComponentLink6URL: https://datasheet.octopart.com:443/B2B-XH-A-%28LF%29%28SN%29-JST-datasheet-62336360.pdf?src-supplier=element14+APAC; ComponentLink6Description: https://datasheet.octopart.com:443/B2B-XH-A-%28LF%29%28SN%29-JST-datasheet-62336360.pdf?src-supplier=element14+APAC; ComponentLink7URL: https://datasheet.octopart.com:443/B2B-XH-A%28LF%29%28SN%29-JST-datasheet-10026044.pdf?src-supplier=TME; ComponentLink7Description: https://datasheet.octopart.com:443/B2B-XH-A%28LF%29%28SN%29-JST-datasheet-10026044.pdf?src-supplier=TME; ComponentLink8URL: https://datasheet.octopart.com:443/B2B-XH-A%28LF%29%28SN%29-JST-datasheet-140264791.pdf?src-supplier=LKR; ComponentLink8Description: https://datasheet.octopart.com:443/B2B-XH-A%28LF%29%28SN%29-JST-datasheet-140264791.pdf?src-supplier=LKR; ComponentLink9URL: https://datasheet.octopart.com:443/B2B-XH-A%28LF%29%28SN%29-JST-datasheet-157850277.pdf?src-supplier=Amar+Radio+Corporation; ComponentLink9Description: https://datasheet.octopart.com:443/B2B-XH-A%28LF%29%28SN%29-JST-datasheet-157850277.pdf?src-supplier=Amar+Radio+Corporation
L20 = XFL4020-222MEC: Inductor Power Shielded Wirewound 2.2uH 20% 1MHz 8A 0.0235Ohm DCR 1515 Automotive T/R; Manufacturer: Coilcraft; Core Material: Composite; DC Resistance (DCR): 23.5mΩ; Number of Circuits: 1; Saturation Current: 3.1A; Self Resonant Frequency: 38MHz; Supplier: Farnell; Supplier Part Number: XFL4020-222MEC; Manufacturer Part Number: XFL4020-222MEC; RoHS: Compliant; Category: Fixed Inductors; Stock: 19584; Pricing: 1=1.97, 50=1.4, 100=1.04, 250=1.02, 500=0.955, 1000=0.895 (GBP); Ambient Temperature Range High: 125°C; Case/Package: 1616; China RoHS: Compliant; Height: 2.1mm; Inductance Tolerance: 20%; Lead Free: Contains Lead; Length: 4mm; Lifecycle Status: Production; Max Current Rating: 8A; Max DC Current: 8A; Max Operating Temperature: 125°C; Min Operating Temperature: -40°C; Mounting Technology: Surface Mount; Number of Terminals: 2; Packaging: Cut Tape; Ratings: AEC-Q200; REACH SVHC: Yes; RMS Current (Irms): 8A; ESR: 23.5mΩ; Shielding: Shielded; Termination: SMD/SMT; Test Frequency: 1MHz; Tolerance: 20%; Width: 4mm; ComponentLink1URL: https://datasheet.octopart.com:443/XFL4020-222MEC-Coilcraft-datasheet-180122279.pdf?src-supplier=IHS; ComponentLink1Description: https://datasheet.octopart.com:443/XFL4020-222MEC-Coilcraft-datasheet-180122279.pdf?src-supplier=IHS; ComponentLink2URL: https://datasheet.octopart.com:443/XFL4020-222MEC-Coilcraft-datasheet-10792328.pdf?src-supplier=Coilcraft+Direct; ComponentLink2Description: https://datasheet.octopart.com:443/XFL4020-222MEC-Coilcraft-datasheet-10792328.pdf?src-supplier=Coilcraft+Direct; ComponentLink3URL: https://datasheet.octopart.com:443/XFL4020-222MEC-Coilcraft-datasheet-14354401.pdf?src-supplier=Newark; ComponentLink3Description: https://datasheet.octopart.com:443/XFL4020-222MEC-Coilcraft-datasheet-14354401.pdf?src-supplier=Newark
R20 = RK73H2BTTD6802F: Res Thick Film 1206 68K Ohm 1% 0.25W(1/4W) ±100ppm/C Pad SMD T/R Automotive AEC-Q200; Manufacturer: KOA Speer; Power Rating: 250mW; Temperature Coefficient: 100ppm/°C; Voltage Rating: 200V; Supplier: Arrow Electronics; Supplier Part Number: RK73H2BTTD6802F; Manufacturer Part Number: RK73H2BTTD6802F; RoHS: Compliant; Category: Chip SMD Resistors; Stock: 10000; Pricing: 10000=0.0041 (USD); Case/Package: 1206; Case Code (Imperial): 1206; Case Code (Metric): 3216; China RoHS: Non-Compliant; Composition: Thick Film; Country of Origin: Japan; Export Control Classification Number (ECCN) Code: EAR99; Height: 600µm; Harmonized Tariff Schedule (HTS) Code: 8533.21.00.30; Introduction Date: 2002-06-01; Lead Free: Lead Free; Length: 3.2mm; Lifecycle Status: Production; Max Operating Temperature: 155°C; Min Operating Temperature: -55°C; Mounting Technology: Surface Mount; Pins: 2; Number of Terminals: 2; Ratings: AEC-Q200; REACH SVHC: Yes; Schedule B: 8533210045; Termination: SMD/SMT; Tolerance: 1%; Width: 1.6mm; Working Voltage: 200V; ComponentLink1URL: https://datasheet.octopart.com:443/RK73H2BTTD6802F-KOA-Speer-datasheet-181956035.pdf?src-supplier=IHS; ComponentLink1Description: https://datasheet.octopart.com:443/RK73H2BTTD6802F-KOA-Speer-datasheet-181956035.pdf?src-supplier=IHS; ComponentLink2URL: https://datasheet.octopart.com:443/RK73H2BTTD6802F-KOA-Speer-datasheet-11590619.pdf?src-supplier=Upverter; ComponentLink2Description: https://datasheet.octopart.com:443/RK73H2BTTD6802F-KOA-Speer-datasheet-11590619.pdf?src-supplier=Upverter; ComponentLink3URL: https://datasheet.octopart.com:443/RK73H2BTTD6802F-KOA-Speer-datasheet-149653815.pdf?src-supplier=Newark; ComponentLink3Description: https://datasheet.octopart.com:443/RK73H2BTTD6802F-KOA-Speer-datasheet-149653815.pdf?src-supplier=Newark; ComponentLink4URL: https://datasheet.octopart.com:443/RK73H2BTTD6802F-KOA-Speer-datasheet-155997623.pdf?src-supplier=Future+Electronics; ComponentLink4Description: https://datasheet.octopart.com:443/RK73H2BTTD6802F-KOA-Speer-datasheet-155997623.pdf?src-supplier=Future+Electronics; ComponentLink5URL: https://datasheet.octopart.com/RK73H-%7C-Flat-Chip-Resistors-%28Precision-Grade%29-KOA-Speer-datasheet-family-85.pdf; ComponentLink5Description: https://datasheet.octopart.com/RK73H-%7C-Flat-Chip-Resistors-%28Precision-Grade%29-KOA-Speer-datasheet-family-85.pdf; ComponentLink6URL: https://datasheet.octopart.com:443/RK73H2BTTD6802F-KOA-Speer-datasheet-10854116.pdf?src-supplier=element14+APAC; ComponentLink6Description: https://datasheet.octopart.com:443/RK73H2BTTD6802F-KOA-Speer-datasheet-10854116.pdf?src-supplier=element14+APAC; ComponentLink7URL: http://sigma.octopart.com:80/rohs_certificate/RK73H-%7C-Flat-Chip-Resistors-%28Precision-Grade%29-KOA-Speer-family-91.pdf?src-supplier=Compliance+Statements; ComponentLink7Description: http://sigma.octopart.com:80/rohs_certificate/RK73H-%7C-Flat-Chip-Resistors-%28Precision-Grade%29-KOA-Speer-family-91.pdf?src-supplier=Compliance+Statements
R21 = ERJPB6B1202V: Res Thick Film 0805 12K Ohm 0.1% 0.25W(1/4W) ±50ppm/C Pad SMD Automotive T/R; Manufacturer: ROHM; Manufacturer Part Number: ESR10EZPJ123; Manufacturer Lifecycle Status: ACTIVE; Part Series: High Precision Thick Film Chip Resistors; Max Power Dissipation: 400mW; Ratings: AEC-Q200, IATF 16949; Temperature Coefficient: 200ppm/°C; Tolerance: 5%; Voltage Rating: 150V; Voltage Rating (DC): 15V; Supplier: DigiKey; Supplier Part Number: RHM12KKTR-ND; RoHS: Compliant; Category: Chip SMD Resistors; Stock: 10000; Pricing: 5000=0.01519, 10000=0.01291 (USD); Case/Package: 0805; Case Code (Imperial): 0805; Case Code (Metric): 2012; Composition: Thick Film; Contact Plating: Tin; Features: Automotive AEC-Q200; Height: 550µm; Lead Free: Lead Free; Length: 2mm; Lifecycle Status: Production; Max Operating Temperature: 155°C; Min Operating Temperature: -55°C; Mounting Technology: Surface Mount; Number of Terminals: 2; Number of Terminations: 2; Power Rating: 400mW; REACH SVHC: Yes; Width: 1.25mm; Working Voltage: 150V; ComponentLink1URL: https://datasheet.octopart.com:443/ESR10EZPJ123-ROHM-datasheet-182147623.pdf?src-supplier=IHS; ComponentLink1Description: https://datasheet.octopart.com:443/ESR10EZPJ123-ROHM-datasheet-182147623.pdf?src-supplier=IHS; ComponentLink2URL: https://datasheet.octopart.com:443/ESR10EZPJ123-Rohm-datasheet-80324120.pdf?src-supplier=Future+Electronics; ComponentLink2Description: https://datasheet.octopart.com:443/ESR10EZPJ123-Rohm-datasheet-80324120.pdf?src-supplier=Future+Electronics; ComponentLink3URL: https://datasheet.octopart.com:443/ESR10EZPJ123-Rohm-datasheet-68299596.pdf?src-supplier=Future+Electronics; ComponentLink3Description: https://datasheet.octopart.com:443/ESR10EZPJ123-Rohm-datasheet-68299596.pdf?src-supplier=Future+Electronics; ComponentLink4URL: https://datasheet.octopart.com:443/ESR10EZPJ123-Rohm-datasheet-8327111.pdf?src-supplier=_legacy+Avnet; ComponentLink4Description: https://datasheet.octopart.com:443/ESR10EZPJ123-Rohm-datasheet-8327111.pdf?src-supplier=_legacy+Avnet; China RoHS: Non-Compliant; Country of Origin: Mainland China, Philippines, South Korea; Export Control Classification Number (ECCN) Code: EAR99; Harmonized Tariff Schedule (HTS) Code: 8533.21.00.30; Introduction Date: 2015-05-13; Thickness: 130µm; ComponentLink5URL: https://datasheet.octopart.com:443/RC0402F123CS-Samsung-Electro-Mechanics-datasheet-141348306.pdf?src-supplier=IHS; ComponentLink5Description: https://datasheet.octopart.com:443/RC0402F123CS-Samsung-Electro-Mechanics-datasheet-141348306.pdf?src-supplier=IHS; ComponentLink6URL: https://datasheet.octopart.com/RC0402F123CS-Samsung-Electro-Mechanics-datasheet-41960856.pdf; ComponentLink6Description: https://datasheet.octopart.com/RC0402F123CS-Samsung-Electro-Mechanics-datasheet-41960856.pdf; Height - Seated (Max): 711.2µm; Packaging: Tape & Reel; Schedule B: 8533210045; ComponentLink7URL: https://datasheet.octopart.com:443/ERJPB6B1202V-Panasonic-datasheet-182147307.pdf?src-supplier=IHS; ComponentLink7Description: https://datasheet.octopart.com:443/ERJPB6B1202V-Panasonic-datasheet-182147307.pdf?src-supplier=IHS; ComponentLink8URL: https://datasheet.octopart.com:443/ERJPB6B1202V-Panasonic-datasheet-82522998.pdf?src-supplier=Panasonic; ComponentLink8Description: https://datasheet.octopart.com:443/ERJPB6B1202V-Panasonic-datasheet-82522998.pdf?src-supplier=Panasonic; ComponentLink9URL: https://datasheet.octopart.com:443/ERJPB6B1202V-Panasonic-datasheet-136610817.pdf?src-supplier=Newark; ComponentLink9Description: https://datasheet.octopart.com:443/ERJPB6B1202V-Panasonic-datasheet-136610817.pdf?src-supplier=Newark; ComponentLink10URL: https://sigma.octopart.com:443/150570796/technical_drawing/Panasonic-ERJPB6B1202V.pdf?src-supplier=Panasonic+SCT; ComponentLink10Description: https://sigma.octopart.com:443/150570796/technical_drawing/Panasonic-ERJPB6B1202V.pdf?src-supplier=Panasonic+SCT; ComponentLink11URL: https://datasheet.octopart.com:443/ERJPB6B1202V-Panasonic-datasheet-177212511.pdf?src-supplier=Burklin+Elektronik; ComponentLink11Description: https://datasheet.octopart.com:443/ERJPB6B1202V-Panasonic-datasheet-177212511.pdf?src-supplier=Burklin+Elektronik
R22 = RES_1206: SMD 3.2mm × 1.6mm size resistor (1206); Manufacturer: *; Manufacturer part number: *
S20 S22 S23 = Triangular SB: Solder Bridge triangular closed
S21 = Soldering Bridge close: Soldering Bridge close SMD
U20 = PMIC-LDO-XC6206P332MR-G(SOT23): 3¦ÌA Fixed 200mA 1 3.3V 1.8V 3.3V 6V 680mV@ 100mA 60mV 0.25%/V SOT-23 , 2.9mm*1.6mm*1.3mm; Manufacturer: Torex; Number of Channels: 1; Voltage Tolerance: 2%; Supplier: DigiKey; Manufacturer Part Number: XC6206P332MR-G; RoHS: Compliant; Category: LDO Voltage Regulators; Stock: 3000; Pricing: 3000=0.24092, 6000=0.23453, 9000=0.23133, 15000=0.22778, 21000=0.22571, 30000=0.22371 (USD); Case/Package: LSSOP; Height - Seated (Max): 1.3mm; Length: 2.9mm; Lifecycle Status: Production; Max Supply Voltage: 6V; Max Operating Temperature: 85°C; Min Input Voltage: 1.8V; Min Operating Temperature: -40°C; Number of Circuits: 1; Number of Outputs: 1; Number of Terminals: 3; Output Voltage: 3.3V; REACH SVHC: Yes; Terminal Pitch: 950µm; Width: 1.6mm; ComponentLink1URL: https://datasheet.octopart.com:443/XC6206P332MR-G-Torex-datasheet-181386674.pdf?src-supplier=IHS; ComponentLink1Description: https://datasheet.octopart.com:443/XC6206P332MR-G-Torex-datasheet-181386674.pdf?src-supplier=IHS; ComponentLink2URL: https://datasheet.octopart.com:443/XC6206P332MR-G-Torex-datasheet-134531119.pdf?src-supplier=TME; ComponentLink2Description: https://datasheet.octopart.com:443/XC6206P332MR-G-Torex-datasheet-134531119.pdf?src-supplier=TME; ComponentLink3URL: https://datasheet.octopart.com:443/XC6206P332MR-G-Torex-datasheet-62046785.pdf?src-supplier=SHENGYU+ELECTRONICS; ComponentLink3Description: https://datasheet.octopart.com:443/XC6206P332MR-G-Torex-datasheet-62046785.pdf?src-supplier=SHENGYU+ELECTRONICS; ComponentLink4URL: https://datasheet.octopart.com:443/XC6206P332MR-G-Torex-datasheet-30458793.pdf?src-supplier=Seeed+Studio; ComponentLink4Description: https://datasheet.octopart.com:443/XC6206P332MR-G-Torex-datasheet-30458793.pdf?src-supplier=Seeed+Studio
U21 = TPS61023DRLR: Switching Voltage Regulators 3.7-A boost converter with 0.5-V ultra-low input vo; Manufacturer: Texas Instruments; Manufacturer Lifecycle Status: ACTIVE; Max Duty Cycle: 97%; Max Junction Temperature (Tj): 125°C; Max Supply Voltage: 5.5V; Min Supply Voltage: 500mV; Nominal Supply Current: 900nA; Number of Channels: 1; Output Current: 3.7A; Supplier: DigiKey; Supplier Part Number: 296-TPS61023DRLRTR-ND; RoHS: Compliant; Category: Voltage Regulators - Switching; Stock: 28000; Pricing: 4000=0.52619, 8000=0.5149, 12000=0.50924 (USD); Height: 600µm; Length: 1.6mm; Lifecycle Status: Production; Max Operating Temperature: 125°C; Min Operating Temperature: -40°C; Number of Outputs: 1; Pins: 6; Thickness: 550µm; Topology: Boost; Width: 1.2mm; ComponentLink1URL: https://sigma.octopart.com:443/181443429/technical_drawing/Texas-Instruments-TPS61023DRLR.pdf?src-supplier=Texas+Instruments; ComponentLink1Description: https://sigma.octopart.com:443/181443429/technical_drawing/Texas-Instruments-TPS61023DRLR.pdf?src-supplier=Texas+Instruments; ComponentLink2URL: https://octopart.com:443/opatz8j6/c1?t=zyOQleeQE8oLSqcAalxdDo3IzngUSb6qW0xoQPFG-OpktvE5sTVhc_u5fgw44jO42BG8o5NLEr2IGCXOilT0ZzZHi8hsfSP8-jfyobuhC8rJog1zy9Po-Mu1Eb699a1TRS2F6YKZGmVxF-MtZwjJGnSs2XBC4L7unR9MEC2OSL8jXNufOWy_70nkXFNc1gPN9bE1BWKJqJdrvkSolJDOb8_OgdP1gf8ZhoZciT4xsMx_e2aPeWGIPyMYnWe1iSdwtP4F6JoCEMvN7e2Kj02C4lo69w7tRubE0ZsGNY9dLxO3XYZKWIKxeoh7nQ82TQOfq_fUKCDCci_4ewscxq_iqWwwYrdWznK4hJhrMZFNlos7TSPV0WhLN2_pC5NqraIp5JHG1eUs1Q&src-supplier=Texas+Instruments; ComponentLink2Description: https://octopart.com:443/opatz8j6/c1?t=zyOQleeQE8oLSqcAalxdDo3IzngUSb6qW0xoQPFG-OpktvE5sTVhc_u5fgw44jO42BG8o5NLEr2IGCXOilT0ZzZHi8hsfSP8-jfyobuhC8rJog1zy9Po-Mu1Eb699a1TRS2F6YKZGmVxF-MtZwjJGnSs2XBC4L7unR9MEC2OSL8jXNufOWy_70nkXFNc1gPN9bE1BWKJqJdrvkSolJDOb8_OgdP1gf8ZhoZciT4xsMx_e2aPeWGIPyMYnWe1iSdwtP4F6JoCEMvN7e2Kj02C4lo69w7tRubE0ZsGNY9dLxO3XYZKWIKxeoh7nQ82TQOfq_fUKCDCci_4ewscxq_iqWwwYrdWznK4hJhrMZFNlos7TSPV0WhLN2_pC5NqraIp5JHG1eUs1Q&src-supplier=Texas+Instruments; ComponentLink3URL: https://sigma.octopart.com:443/179311942/technical_drawing/Texas-Instruments-TPS61023DRLR.pdf?src-supplier=Texas+Instruments; ComponentLink3Description: https://sigma.octopart.com:443/179311942/technical_drawing/Texas-Instruments-TPS61023DRLR.pdf?src-supplier=Texas+Instruments; ComponentLink4URL: https://sigma.octopart.com:443/158890725/technical_drawing/Texas-Instruments-TPS61023DRLR.pdf?src-supplier=Texas+Instruments; ComponentLink4Description: https://sigma.octopart.com:443/158890725/technical_drawing/Texas-Instruments-TPS61023DRLR.pdf?src-supplier=Texas+Instruments; ComponentLink5URL: https://sigma.octopart.com:443/149978429/technical_drawing/Texas-Instruments-TPS61023DRLR.pdf?src-supplier=Texas+Instruments; ComponentLink5Description: https://sigma.octopart.com:443/149978429/technical_drawing/Texas-Instruments-TPS61023DRLR.pdf?src-supplier=Texas+Instruments; ComponentLink6URL: https://datasheet.octopart.com:443/TPS61023DRLR-Texas-Instruments-datasheet-152518939.pdf?src-supplier=Upverter; ComponentLink6Description: https://datasheet.octopart.com:443/TPS61023DRLR-Texas-Instruments-datasheet-152518939.pdf?src-supplier=Upverter; ComponentLink7URL: https://datasheet.octopart.com:443/TPS61023DRLR-Texas-Instruments-datasheet-182474952.pdf?src-supplier=LCSC; ComponentLink7Description: https://datasheet.octopart.com:443/TPS61023DRLR-Texas-Instruments-datasheet-182474952.pdf?src-supplier=LCSC; ComponentLink8URL: https://datasheet.octopart.com:443/TPS61023DRLR-Texas-Instruments-datasheet-163726964.pdf?src-supplier=LCSC; ComponentLink8Description: https://datasheet.octopart.com:443/TPS61023DRLR-Texas-Instruments-datasheet-163726964.pdf?src-supplier=LCSC; ComponentLink9URL: http://sigma.octopart.com:80/reach_statement/Texas-Instruments-company-64.pdf?src-supplier=Compliance+Statements; ComponentLink9Description: http://sigma.octopart.com:80/reach_statement/Texas-Instruments-company-64.pdf?src-supplier=Compliance+Statements; ComponentLink10URL: http://sigma.octopart.com:80/conflict_mineral_statement/Texas-Instruments-company-63.pdf?src-supplier=Compliance+Statements; ComponentLink10Description: http://sigma.octopart.com:80/conflict_mineral_statement/Texas-Instruments-company-63.pdf?src-supplier=Compliance+Statements; Manufacturer Part Number: TPS61023DRLR

## Nets that join several sheets
+3V3: MCU (11 pins), Peripherals (10 pins), Power (C21.2 TP22.1 U20.2)
+4V: Communication (C40.2 Q40.2 R40.1 S40.1), Power (5 pins)
GND: Communication (C40.1 Q41.2 SIM40.5), MCU (15 pins), Peripherals (8 pins), Power (9 pins)
I2C1_SCL: MCU (U30.42), Peripherals (J50.3 P50.3)
I2C1_SDA: MCU (U30.43), Peripherals (J50.4 P50.4)
NetB50_2: MCU (U30.15), Peripherals (B50.2 TP50.1)
NetJ51_1: MCU (U30.13), Peripherals (J51.1)
NetJ51_2: MCU (U30.14), Peripherals (J51.2)
NetJ52_3: MCU (U30.11), Peripherals (J52.3 R50.1)
NetJ53_3: MCU (U30.10), Peripherals (J53.3 R51.1)
NetJ54_3: MCU (U30.12), Peripherals (J54.3 R52.1)
NetJ55_1: MCU (U30.41), Peripherals (J55.1 R53.1)
NetP51_2: MCU (U30.34), Peripherals (P51.2)
NetP51_3: MCU (U30.37), Peripherals (P51.3)
NetR41_1: Communication (R41.1), MCU (U30.19)
NetS41_1: Communication (S41.1), MCU (U30.25)
NetS42_1: Communication (S42.1), MCU (U30.30)
NetS43_1: Communication (S43.1), MCU (U30.21)
NetS44_1: Communication (S44.1), MCU (U30.22)
NetS45_1: Communication (S45.1), MCU (U30.31)